# Altium schematic sheet SCS_Battery_RevA.SchDoc
size A3; _PRJ_TITLE: PROJECT TITLE; _SHT_TITLE: Sheet; _REV: A; PageSetup: Record=PageOptions|CenterHorizontal=True|CenterVertical=True|PrintScale=0.71|XCorrection=1.00|YCorrection=1.00|PrintKind=0|BorderSize=5000000|LeftOffset=0|BottomOffset=0|Orientation=2|PaperLength=1000|PaperWidth=1000|Scale=100|PaperSource=258|PrintQuality=600|MediaType=1|DitherType=10|PaperKind=A3 (297x420mm)|PrintScaleMode=1
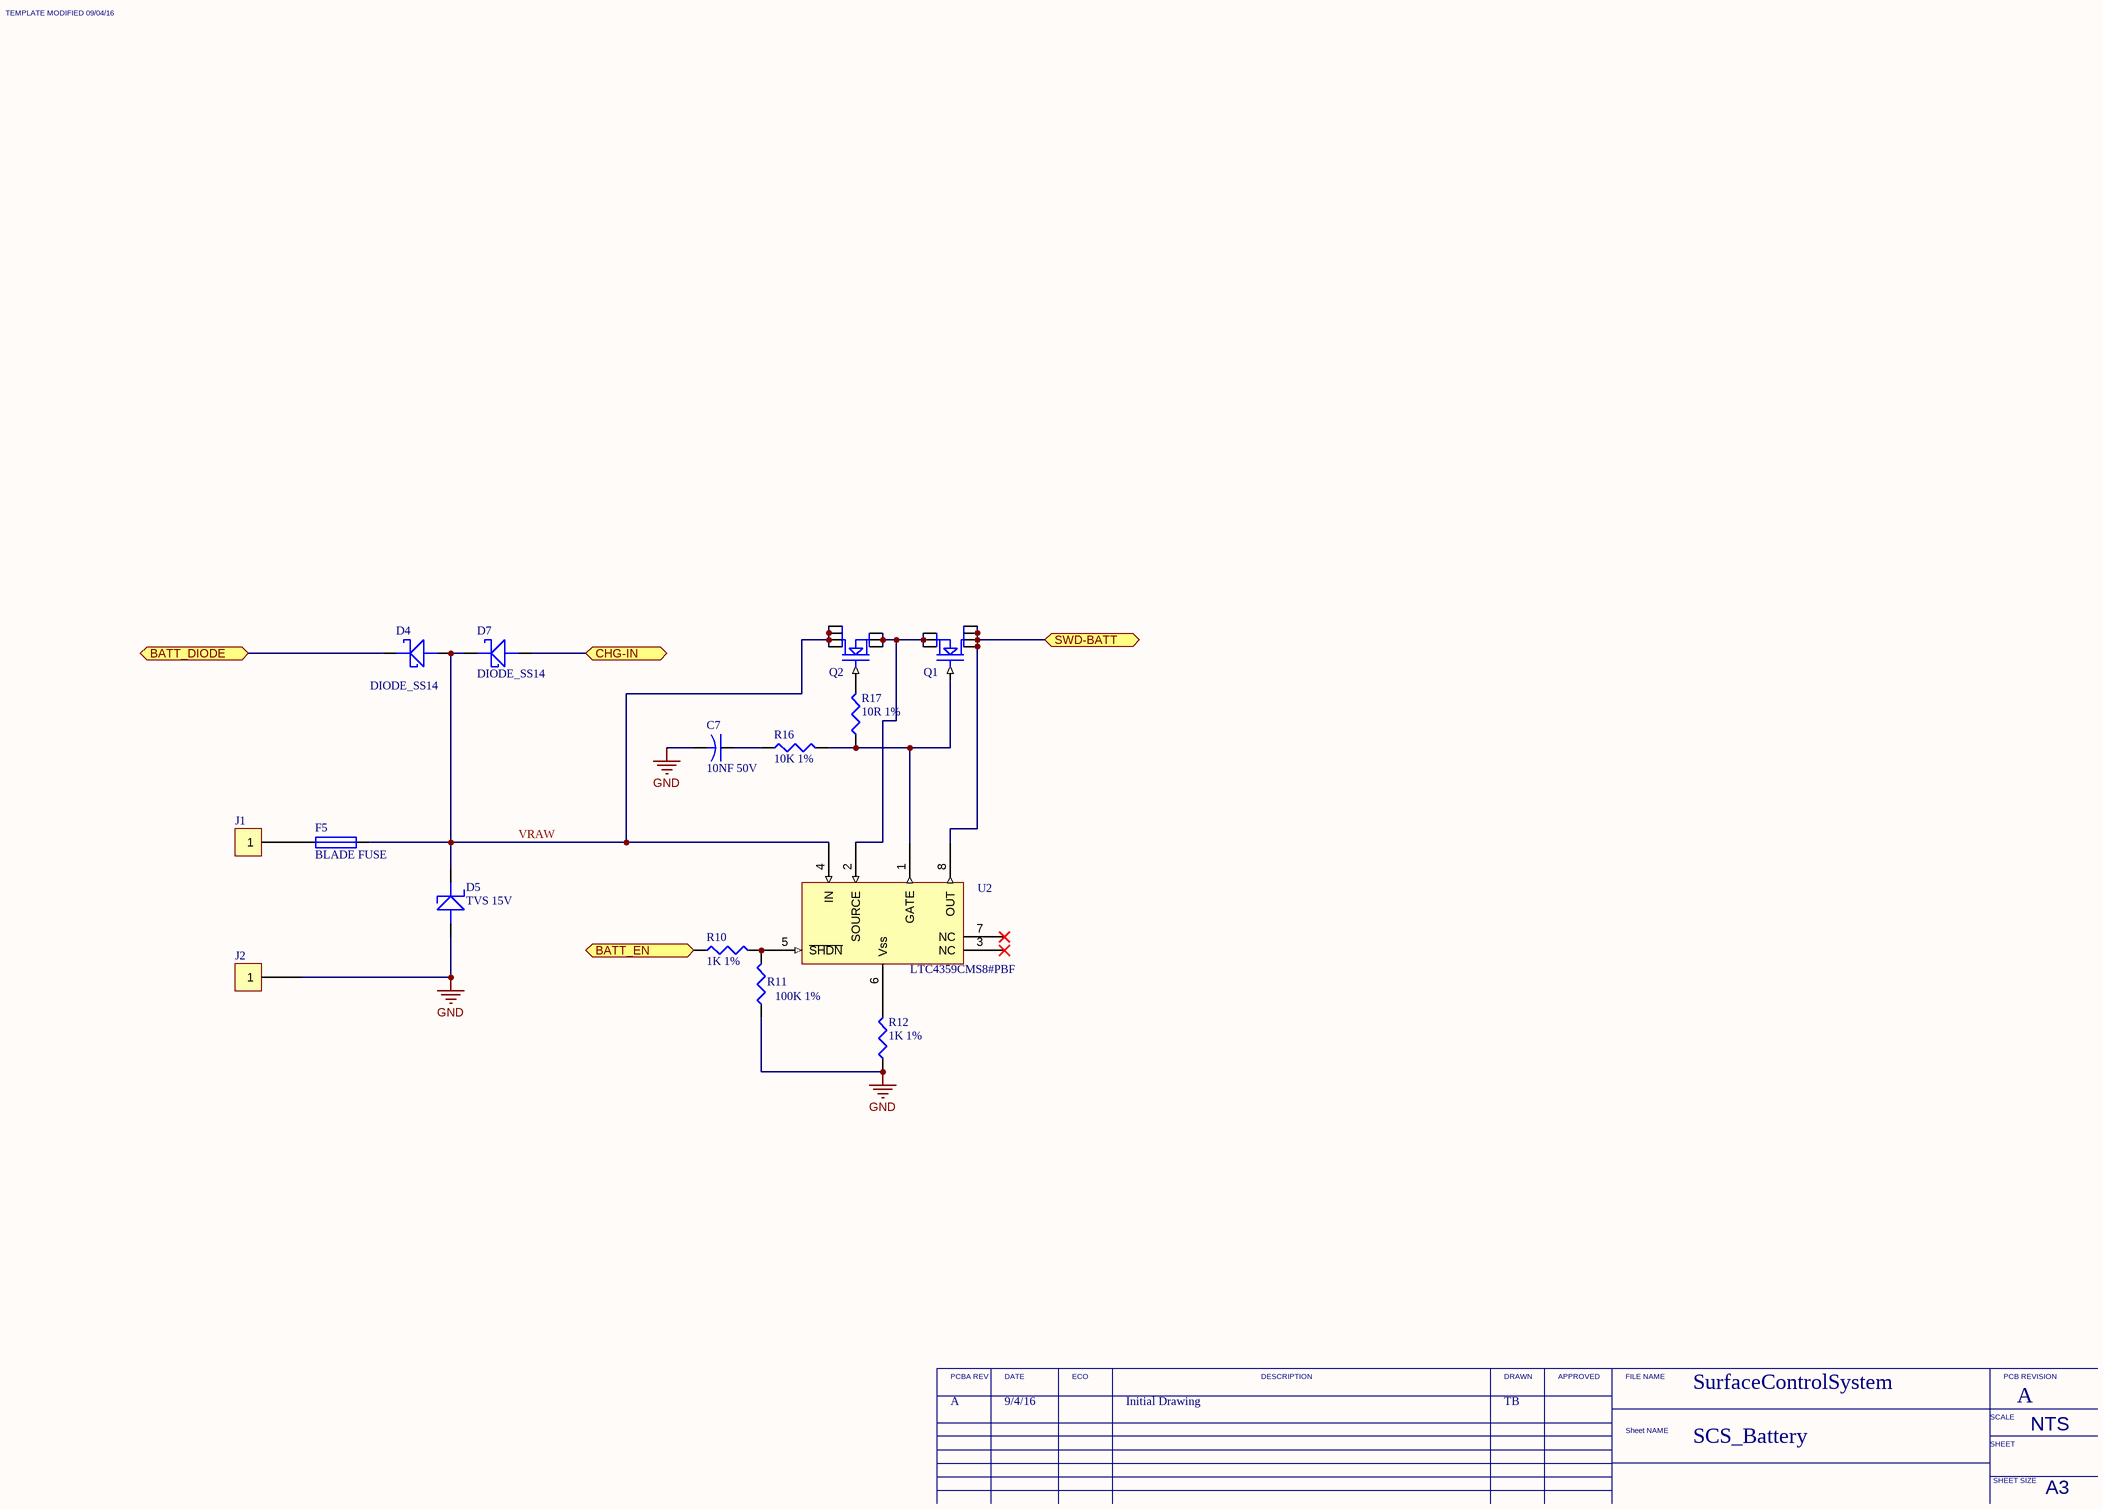
[diagram p0: SCS_Battery_RevA.SchDoc]

## Parts
C7  10NF 50V  [0603]
D4  DIODE_SS14  [DO-214AC]
D5  TVS 15V  [DO-214AB]
D7  DIODE_SS14  [DO-214AC]
F5  BLADE FUSE  [FUSEHOLDER_BLADE]
J1  5mm Pitch 6.3mm SPADE  [CON_5mm_6.3MM_SPADE]  (value not drawn)
J2  5mm Pitch 6.3mm SPADE  [CON_5mm_6.3MM_SPADE]  (value not drawn)
Q1  N Channel FET  [SO-8]  (value not drawn)
Q2  N Channel FET  [SO-8]  (value not drawn)
R10  1K 1%  [0603]
R11  100K 1%  [0603]
R12  1K 1%  [0603]
R16  10K 1%  [0603]
R17  10R 1%  [0603]
U2  LTC4359CMS8#PBF  [TSOP65P490X110-8M]

## Ports
BATT_DIODE (bidir), BATT_EN (in), CHG-IN (bidir), SWD-BATT (bidir)

## Nets
GND: C7.2 D5.A J2.1 R11.1 R12.1
BATT_DIODE: D4.K ; port BATT_DIODE
BATT_EN: R10.1 ; port BATT_EN
CHG-IN: D7.A ; port CHG-IN
SWD-BATT: Q1.5(DRAIN) Q1.6(DRAIN) Q1.7(DRAIN) Q1.8(DRAIN) U2.8(OUT) ; port SWD-BATT
VRAW: D4.A D5.K D7.K F5.2 Q2.5(DRAIN) Q2.6(DRAIN) Q2.7(DRAIN) Q2.8(DRAIN) U2.4(IN)
NetC7_1: C7.1 R16.1
NetF5_1: F5.1 J1.1
NetQ1_1: Q1.1(SOURCE) Q1.2(SOURCE) Q1.3(SOURCE) Q2.1(SOURCE) Q2.2(SOURCE) Q2.3(SOURCE) U2.2(SOURCE)
NetQ1_4: Q1.4(GATE) R16.2 R17.1 U2.1(GATE)
NetQ2_4: Q2.4(GATE) R17.2
NetR10_2: R10.2 R11.2 U2.5(~{SHDN})
NetR12_2: R12.2 U2.6(Vss)

Not connected (* = marked no-connect by the designer): U2 3(NC)* 7(NC)*

## Notes on the sheet
- SurfaceControlSystem
- A
- 9/4/16
- Initial Drawing
- TB
- SCS_Battery
- TEMPLATE MODIFIED 09/04/16
- PCBA REV
- DATE
- ECO
- DESCRIPTION
- DRAWN
- APPROVED
- FILE NAME
- PCB REVISION
- Sheet NAME
- SCALE
- SHEET
- NTS
- SHEET SIZE
- A3

## Library data of the parts
C7 = CAP_10NF_50V_10%_0603: CAP CER 10NF 50V 10% X7R 0603; Manufacturer: Murata; Manufacturer P/N: GRM188R71H103KA01D
D4 D7 = DIODE_SS14: Schottky Diode, 1A, 40V SS14; Manufacturer: Fairchild; Manufacturer P/N: SS14
D5 = DIODE_TVS_SMCJ15A: TVS Diode, 15V; Manufacturer: LIttlefuse; Manufacturer P/N: SMCJ15A
F5 = FUSE_BLADE_500V_30A_PCB: FUSE CLIP BLADE 500V 30A PCB; Manufacturer: Keystone Electronics; Manufacturer P/N: 3522-2
J1 J2 = CON_5mm_6.3MM_SPADE: Manufacturer: Dinkle; Manufacturer P/N: P-850
Q1 Q2 = Q_AO4578: MOSFET N-CH 30V 20A LFPAK; Manufacturer: Alpha & Omega Semiconductor Inc.; Manufacturer P/N: AO4578
R10 R12 = RES_1K_1%_0603: Resistor, 1K, 1%, 0603; Manufacturer: Bourns Inc; Manufacturer P/N: CR0603-FX-1001ELF
R11 = RES_100K_1%_0603: Resistor, 100K, 1%, 0603; Manufacturer: Bourns Inc; Manufacturer P/N: CRT0603-BY-1003ELF
R16 = RES_10K_1%_0603: Resistor, 10K, 1%, 0603; Manufacturer: Bourns Inc; Manufacturer P/N: CR0603-FX-1002HLF
R17 = RES_10R_1%_0603: Resistor, 10R, 1%, 0603; Manufacturer: Bourns Inc; Manufacturer P/N: CR0603-FX-10R0ELF
U2 = IC_LTC4359: Ideal Diode Controller; Manufacturer: Linear Technology; Manufacturer P/N: LTC4359CMS8#PBF